# Altium schematic sheet JHZ-E01S-HW-Sensor-X1-S0.1-磁编码器AS5600-20160919.SchDoc
size A4
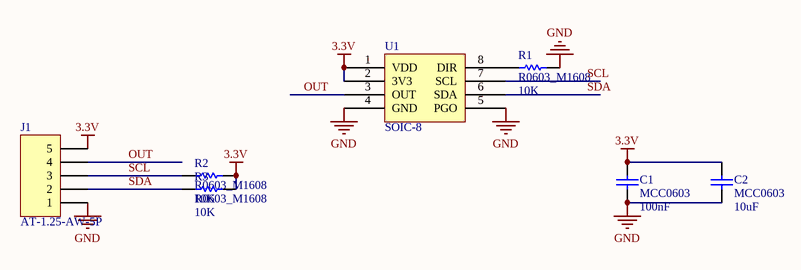
[diagram p0: JHZ-E01S-HW-Sensor-X1-S0.1-磁编码器AS5600-20160919.SchDoc]

## Parts
C1  MCC0603  value 100nF  [C0603_M1608]
C2  MCC0603  value 10uF  [C0603_M1608]
J1  AT-1.25-AW-5P  [AT-1.25-AW-5P]
R1  R0603_M1608  value 10K  [R0603_M1608]
R2  R0603_M1608  value 10K  [R0603_M1608]
R3  R0603_M1608  value 10K  [R0603_M1608]
U1  SOIC-8  [SOIC-8]

## Nets
3.3V: C1.1 C2.1 J1.5 R2.1 R3.1 U1.1(VDD) U1.2(3V3)
GND: C1.2 C2.2 J1.1 R1.2 U1.4(GND) U1.5(PGO)
OUT: J1.4 U1.3(OUT)
SCL: J1.3 R2.2 U1.7(SCL)
SDA: J1.2 R3.2 U1.6(SDA)
NetR1_1: R1.1 U1.8(DIR)

## Library data of the parts
C1 C2 = MCC0603: Multilayer Ceramic Capacitor 0603
J1 = 1.25T-1-A-5P: Header, 1.25mm,5-Pin; Value: AT-1.25-AW-5P
R1-R3 = R0603_M1608: Resistor
U1 = AS5600